# Altium project template.PrjPcb
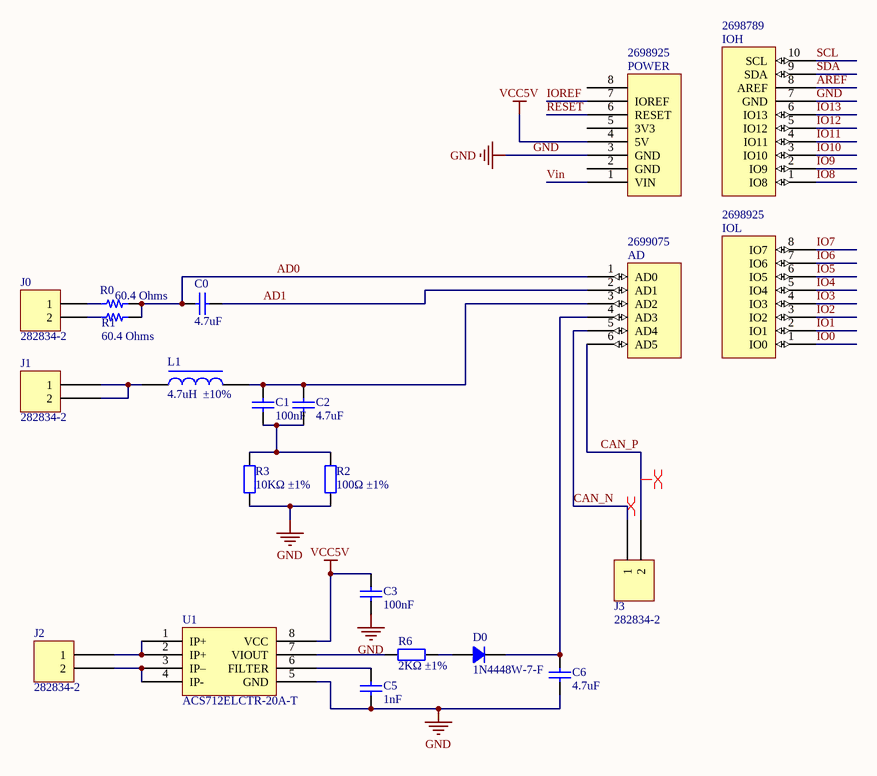
[diagram p0: Schematic.SchDoc]
1 sheet, 22 parts. Net scope: global (net labels, ports and power ports of the same name join across sheets).
Board files: ArduinoUnoShield.PcbDoc, PCB.PcbDoc

## Sheet Schematic.SchDoc
size A4

### Parts
AD  Supplier Part Number 4: 2699075  [Header 6x1 8.5mm]  (hidden comment: AD)
C0  4.7uF  [1206_C]
C1  100nF  [0603_C]
C2  4.7uF  [1206_C]
C3  100nF  [1206_C]
C5  1nF  [0402_C]
C6  4.7uF  [0402_C]
D0  1N4448W-7-F  [SOD-123]
IOH  Supplier Part Number 3: 2698789  [Header 10x1 8.5mm]  (hidden comment: IOH)
IOL  Supplier Part Number 4: 2698925  [Header 8x1 8.5mm]  (hidden comment: IOL)
J0  282834-2  [TE 282834-2]
J1  282834-2  [TE 282834-2]
J2  282834-2  [TE 282834-2]
J3  282834-2  [TE 282834-2]
L1  4.7uH  ±10%  [1206_L]
POWER  Supplier Part Number 4: 2698925  [Header 8x1 8.5mm]  (hidden comment: POWER_UNO)
R0  60.4 Ohms  [RES 0805_2012]
R1  60.4 Ohms  [RES 0805_2012]
R2  100Ω ±1%  [1206_R]
R3  10KΩ ±1%  [1206_R]
R6  2KΩ ±1%  [0402_R]
U1  ACS712ELCTR-20A-T  [SOIC-8_150mil]

### Nets
GND: C3.1 C5.1 C6.1 IOH.7(GND) POWER.3(GND) R2.1 R3.1 U1.5(GND)
VCC5V: C3.2 POWER.4(5V) U1.8(VCC)
AD0: AD.1(AD0) C0.1 R0.1 R1.1
AD1: AD.2(AD1) C0.2
AREF: IOH.8(AREF)
CAN_N: AD.5(AD4) J3.1
CAN_P: AD.6(AD5) J3.2
IO0: IOL.1(IO0)
IO1: IOL.2(IO1)
IO2: IOL.3(IO2)
IO3: IOL.4(IO3)
IO4: IOL.5(IO4)
IO5: IOL.6(IO5)
IO6: IOL.7(IO6)
IO7: IOL.8(IO7)
IO8: IOH.1(IO8)
IO9: IOH.2(IO9)
IO10: IOH.3(IO10)
IO11: IOH.4(IO11)
IO12: IOH.5(IO12)
IO13: IOH.6(IO13)
IOREF: POWER.7(IOREF)
RESET: POWER.6(RESET)
SCL: IOH.10(SCL)
SDA: IOH.9(SDA)
Vin: POWER.1(VIN)
NetAD_3: AD.3(AD2) C1.2 C2.1 L1.2
NetAD_4: AD.4(AD3) C6.2 D0.2
NetC1_1: C1.1 C2.2 R2.2 R3.2
NetC5_2: C5.2 U1.6(FILTER)
NetD0_1: D0.1 R6.2
NetJ0_1: J0.1 R0.2
NetJ0_2: J0.2 R1.2
NetJ1_1: J1.1 J1.2 L1.1
NetJ2_1: J2.1 U1.1(IP+) U1.2(IP+)
NetJ2_2: J2.2 U1.3(IP–) U1.4(IP-)
NetR6_1: R6.1 U1.7(VIOUT)

Not connected (* = marked no-connect by the designer): POWER 2(GND) 5(3V3) 8

### Layout directives
differential pair: CAN_N, CAN_P

### Library data of the parts
C0 C2 = 1206 4.7uF (475) 10% 50V: Chip capacitors; Manufacturer: Guangdong Fenghua Advanced Tech; PartNumber: 1206B475K500NT; Tolerance: 10%; Voltage: 50V; ComponentLink1Description: Supplier link; ComponentLink1URL: http://www.szlcsc.com/product/details_30577.html; Package: 1206; Supplier: LC; SuppliersPartNumber: C29823; Capacitance: 4.7uF
C1 = 0603 100nF (104) 10% 50V: Chip capacitors; Manufacturer: YAGEO; PartNumber: CC0603KRX7R9BB104; Tolerance: 10%; Voltage: 50V; ComponentLink1Description: Supplier link; ComponentLink1URL: http://www.szlcsc.com/product/details_15331.html; Package: 0603; Supplier: LC; SuppliersPartNumber: C14663; Capacitance: 100nF
C3 = 1206 100nF (104) 10% 50V: Chip capacitors; Manufacturer: Samsung Electro-Mechanics; PartNumber: CL31B104KBCNNNC; Tolerance: 10%; Voltage: 50V; ComponentLink1Description: Supplier link; ComponentLink1URL: http://www.szlcsc.com/product/details_25237.html; Package: 1206; Supplier: LC; SuppliersPartNumber: C24497; Capacitance: 100nF
C5 = 0402 1nF (102) 10% 50V: Chip capacitor; Manufacturer: Guangdong Fenghua Advanced Tech; PartNumber: 0402B102K500NT; Tolerance: 10%; Voltage: 50V; ComponentLink1Description: Supplier link; ComponentLink1URL: http://www.szlcsc.com/product/details_1875.html; Package: 0402; Supplier: LC; SuppliersPartNumber: C1523; Capacitance: 1nF
C6 = 0402 4.7uF (475) 20% 10V: Chip capacitor; Manufacturer: Samsung Electro-Mechanics; PartNumber: CL05A475MP5NRNC; Tolerance: 20%; Voltage: 10V; ComponentLink1Description: Supplier link; ComponentLink1URL: http://www.szlcsc.com/product/details_24469.html; Package: 0402; Supplier: LC; SuppliersPartNumber: C23733; Capacitance: 4.7uF
D0 = 1N4448W-7-F: DIODE GEN PURP 75V 250MA SOD123; Manufacturer: Diodes Incorporated; Current - Reverse Leakage @ Vr: 2.5µA @ 75V; Diode Type: Standard; Reverse Recovery Time (trr): 4ns; Speed: Fast Recovery =< 500ns, > 200mA (Io); Voltage - Forward (Vf) (Max) @ If: 1.25V @ 150mA; Part Number: 1N4448W-7-F; ComponentLink1Description: Datasheet; ComponentLink1URL: https://www.diodes.com/assets/Datasheets/ds12002.pdf; ComponentLink2Description: DigiKey Link; ComponentLink2URL: http://digikey.com/product-detail/en/diodes-incorporated/1N4448W-7-F/1N4448W-FDICT-ND/717799; Current - Average Rectified (Io): 250mA; LastUpdated: 2020-09-02 1:19:08 AM; Lifecycle Status: Active; Minimum Order: 1; Mounting Type: Surface Mount; Operating Temperature - Junction: -65°C ~ 150°C; Package / Case: SOD-123; Packaging: TapeAndReel; PartId: 1003; Part Status: Active; Price: 0.03; Series: -; Supplier 1: DigiKey; Supplier Part Number 1: 1N4448W-FDICT-ND; Supplier Device Package: SOD-123; Voltage - DC Reverse (Vr) (Max): 75V
J0-J3 = 282834-2: TERM BLK 2P SIDE ENT 2.54MM PCB; Manufacturer: TE Connectivity AMP Connectors; Current: 10A; Mating Orientation: Horizontal with Board; Number of Levels: 1; Pitch: 0.100" (2.54mm); Positions Per Level: 2; Voltage: 150V; Wire Gauge: 16-30 AWG; Wire Termination: Screw - Rising Cage Clamp; Part Number: 282834-2; Color: Green; ComponentLink1Description: Datasheet; ComponentLink1URL: https://www.te.com/commerce/DocumentDelivery/DDEController?Action=srchrtrv&DocNm=282834&DocType=Customer+Drawing&DocLang=English; ComponentLink2Description: DigiKey Link; ComponentLink2URL: http://digikey.com/product-detail/en/te-connectivity-amp-connectors/282834-2/A98333-ND/1150135; LastUpdated: 2020-01-15 4:15:38 AM; Lifecycle Status: Active; Minimum Order: 1; Mounting Type: Through Hole; Packaging: Bulk; Part Status: Active; Price: 0.88; Series: Buchanan; Supplier 1: DigiKey; Supplier Part Number 1: A98333-ND
L1 = 1206 4.7uH  10%: 贴片电感; ComponentLink1Description: 供应商链接; ComponentLink1URL: http://www.szlcsc.com/product/details_1401.html; Package: 1206; Supplier: LC; SuppliersPartNumber: C1049
R0 R1 = RMCF0805FT60R4: RES 60.4 OHM 1% 1/8W 0805; Manufacturer: Stackpole Electronics Inc; Power (Watts): 0.125W, 1/8W; Temperature Coefficient: ±100ppm/°C; Part Number: RMCF0805FT60R4; Value: 60.4 Ohms; ComponentLink1Description: Datasheet; ComponentLink1URL: https://www.seielect.com/catalog/sei-packaging.pdf; ComponentLink2Description: DigiKey Link; ComponentLink2URL: http://digikey.com/product-detail/en/stackpole-electronics-inc/RMCF0805FT60R4/RMCF0805FT60R4CT-ND/1942327; Composition: Thick Film; Device Package: 0805 (2012 Metric); Features: Automotive AEC-Q200; Height - Seated (Max): 0.026" (0.65mm); LastUpdated: 2020-09-02 1:15:14 AM; Lifecycle Status: Active; Minimum Order: 1; Number of Terminations: 2; Operating Temperature: -55°C ~ 155°C; Package / Case: 0805 (2012 Metric); Packaging: CutTape; PartId: 32532; Part Status: Active; Price: 0.10; Ratings: AEC-Q200; Resistance: 60.4 Ohms; Series: RMCF; Size / Dimension: 0.079" L x 0.049" W (2.00mm x 1.25mm); Supplier 1: DigiKey; Supplier Part Number 1: RMCF0805FT60R4CT-ND; Supplier Device Package: 0805; Tolerance: ±1%
R2 = 1206 100R (1000) 1%: Chip resistor; Manufacturer: Uniroyal Elec; Power: 1/4W; ComponentLink1Description: Supplier link; ComponentLink1URL: http://www.szlcsc.com/product/details_18589.html; Package: 1206; Supplier: LC; SuppliersPartNumber: C17901; Tolerance: 1%
R3 = 1206 10K (1002) 1%: Chip resistor; Manufacturer: Uniroyal Elec; Power: 1/4W; ComponentLink1Description: Supplier link; ComponentLink1URL: http://www.szlcsc.com/product/details_18590.html; Package: 1206; Supplier: LC; SuppliersPartNumber: C17902; Tolerance: 1%
R6 = 0402 2K (2001) 1%: Chip resistor; Manufacturer: Uniroyal Elec; PartNumber: 0402WGF2001TCE; Power: 1/16W; ComponentLink1Description: Supplier link; ComponentLink1URL: http://www.szlcsc.com/product/details_4516.html; Package: 0402; Supplier: LC; SuppliersPartNumber: C4109; Resistance: 2KΩ; Tolerance: 1%
U1 = ACS712ELCTR-20A-T_[C10681]: 传感器; ComponentLink1Description: 供应商链接; ComponentLink1URL: http://www.szlcsc.com/product/details_11225.html; Package: SOIC-8_150mil; Supplier: LC; SuppliersPartNumber: C10681
AD = AD: Supplier 1: Arrow; Supplier Part Number 1: 2699089; Supplier 2: Digi-Key; Supplier Part Number 2: SAM1198-06-ND; Supplier 3: Arrow; Supplier Part Number 3: 2699088; Supplier 4: Arrow
IOH = IOH: Supplier 1: Arrow; Supplier Part Number 1: 2698803S4475693N1004; Supplier 2: Digi-Key; Supplier Part Number 2: SAM1198-10-ND; Supplier 3: Arrow
IOL = IOL: Supplier 1: Digi-Key; Supplier Part Number 1: SAM1198-08-ND; Supplier 2: Arrow; Supplier Part Number 2: 2698939; Supplier 3: Arrow; Supplier Part Number 3: 2698940; Supplier 4: Arrow
POWER = POWER_UNO: Supplier 1: Digi-Key; Supplier Part Number 1: SAM1198-08-ND; Supplier 2: Arrow; Supplier Part Number 2: 2698939; Supplier 3: Arrow; Supplier Part Number 3: 2698940; Supplier 4: Arrow